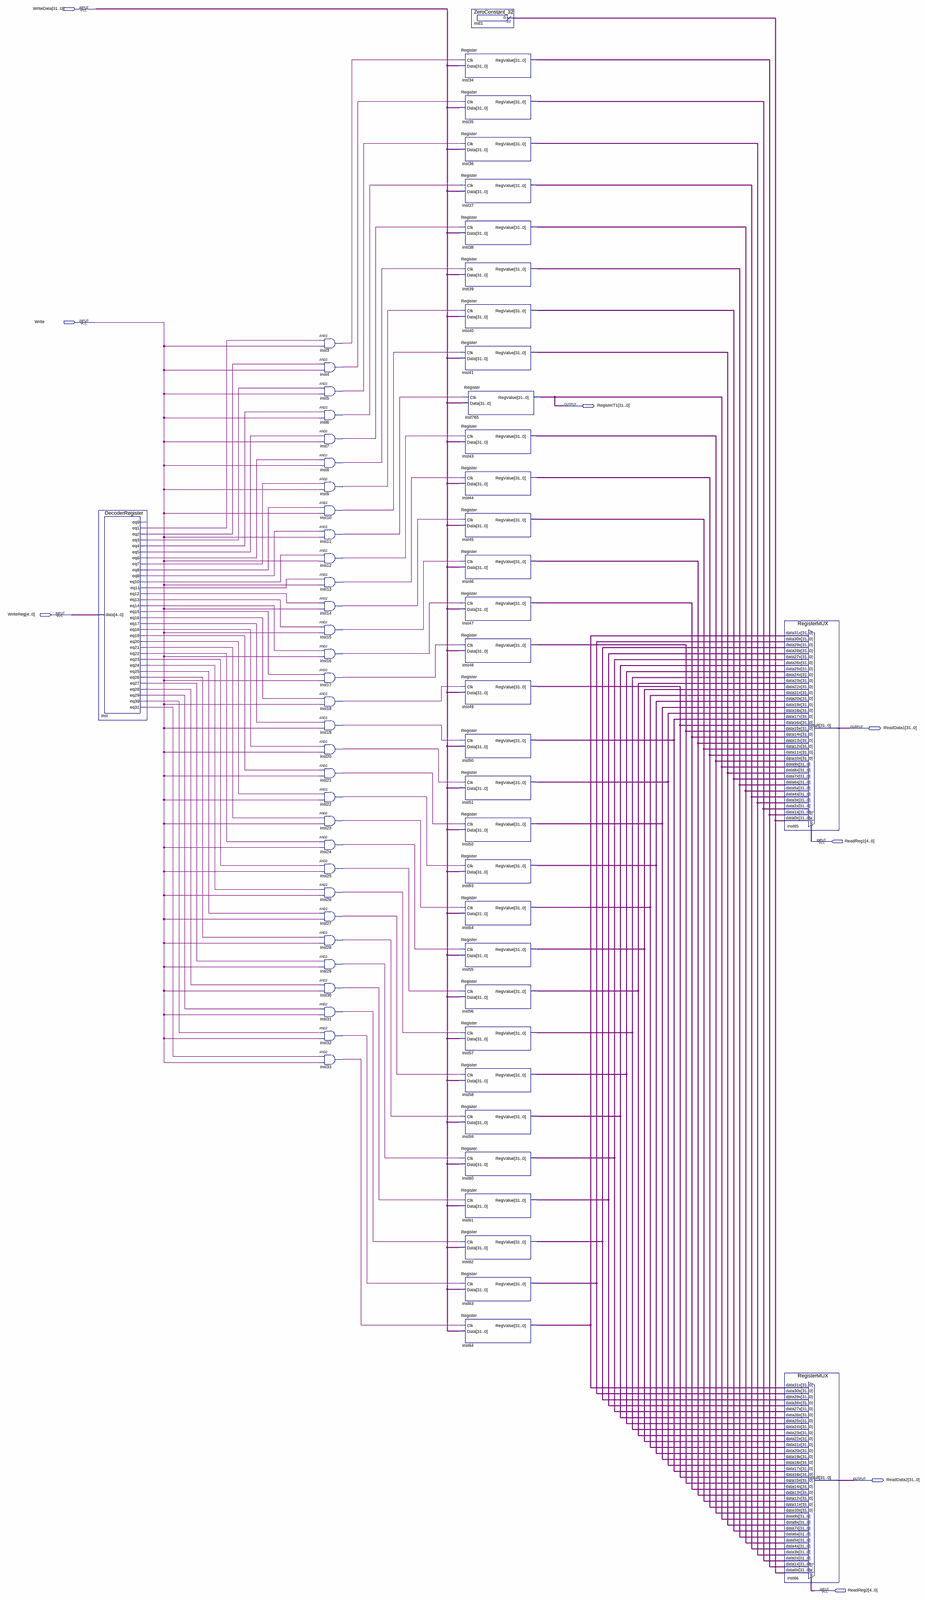
[diagram p0: schematic sheet, whole]
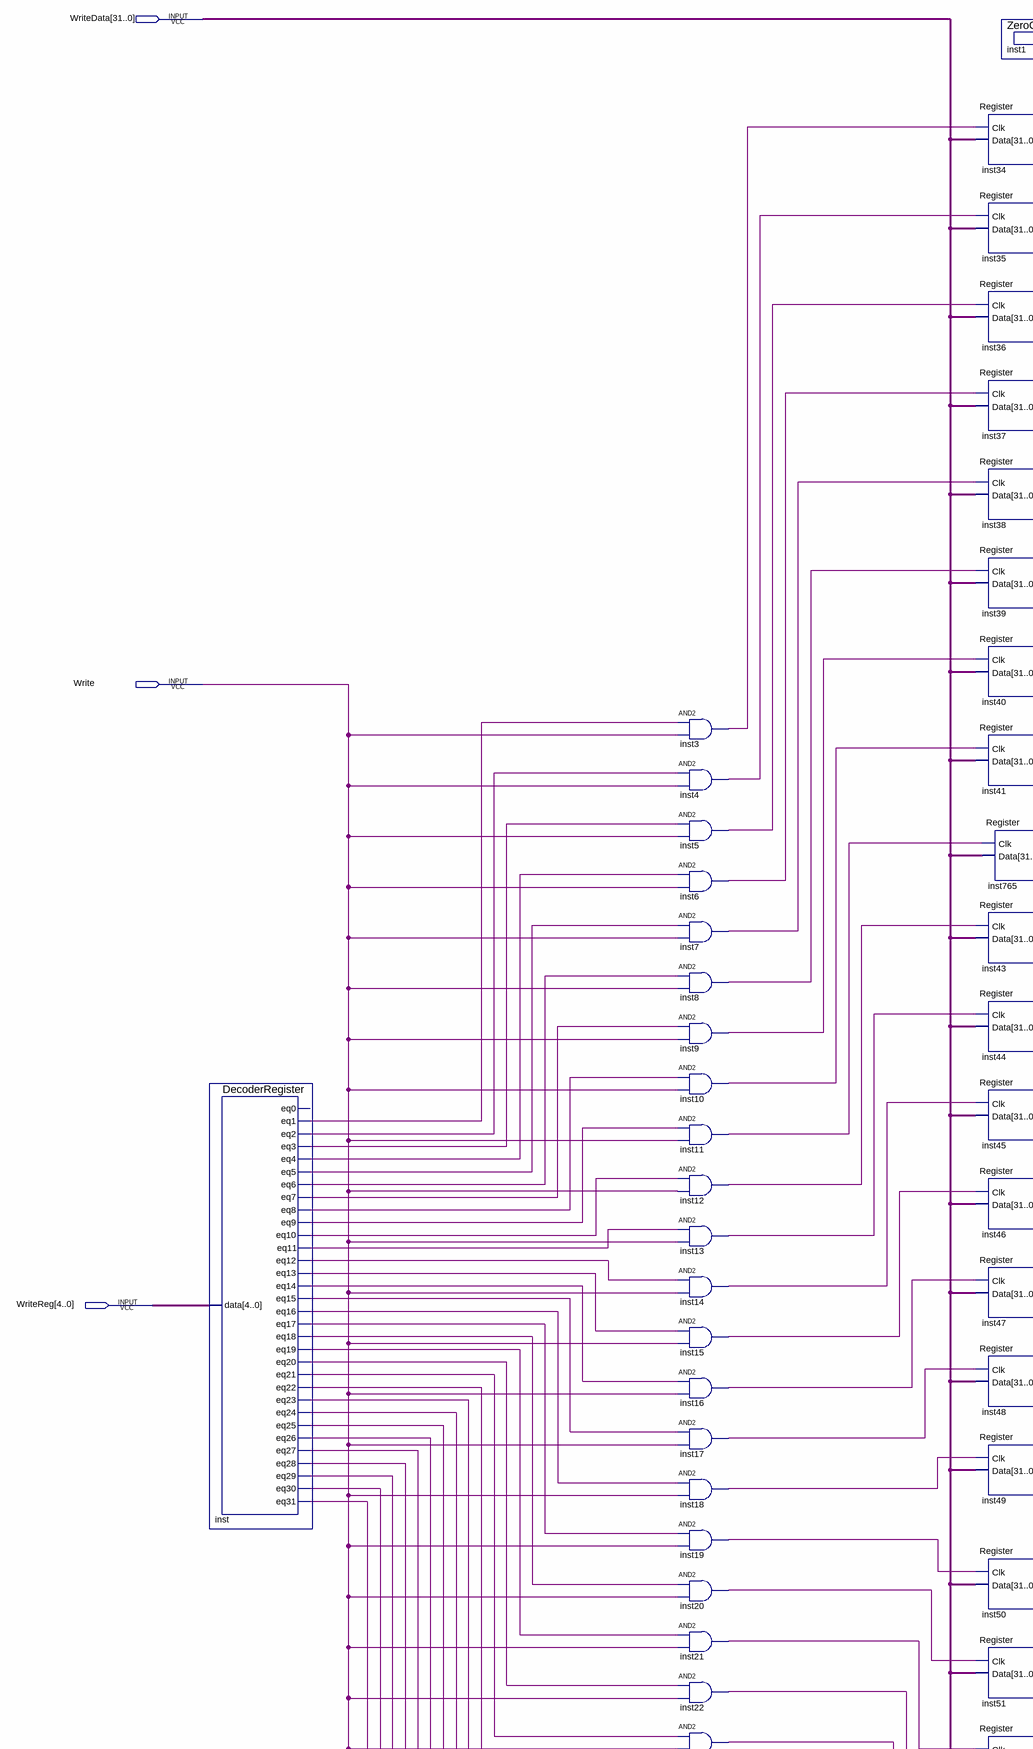
[diagram p1: schematic sheet, upper left part]
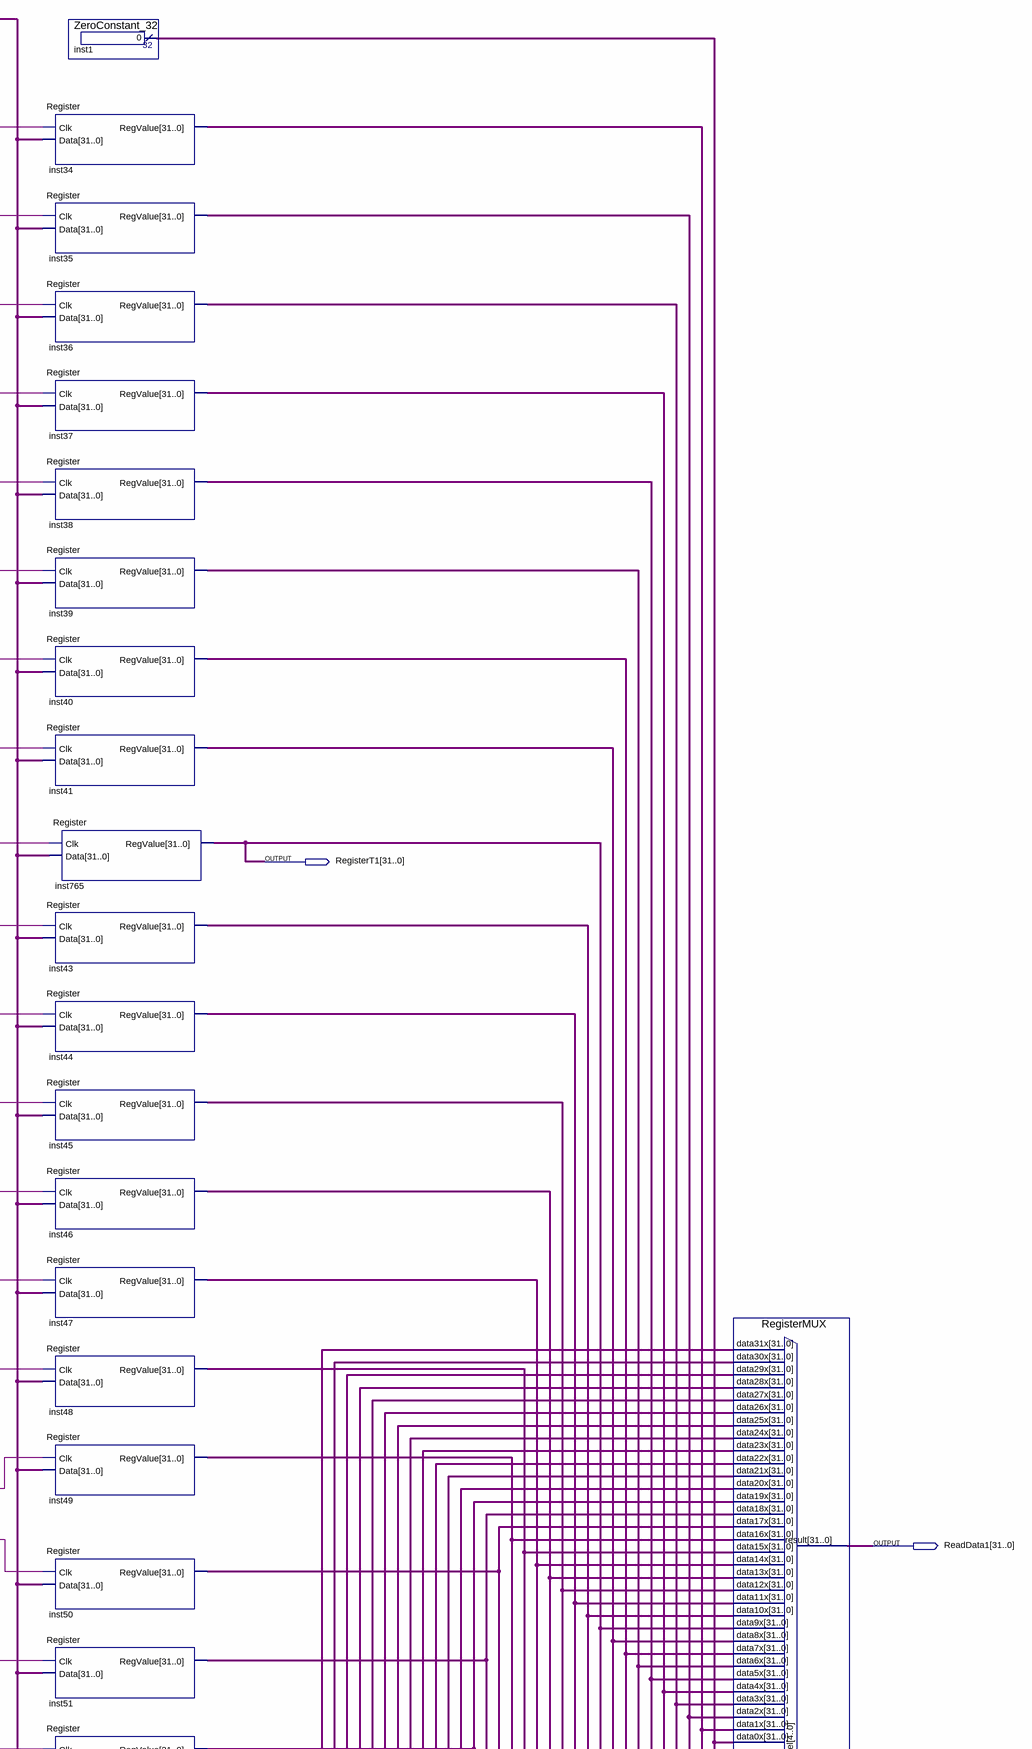
[diagram p2: schematic sheet, upper right part]
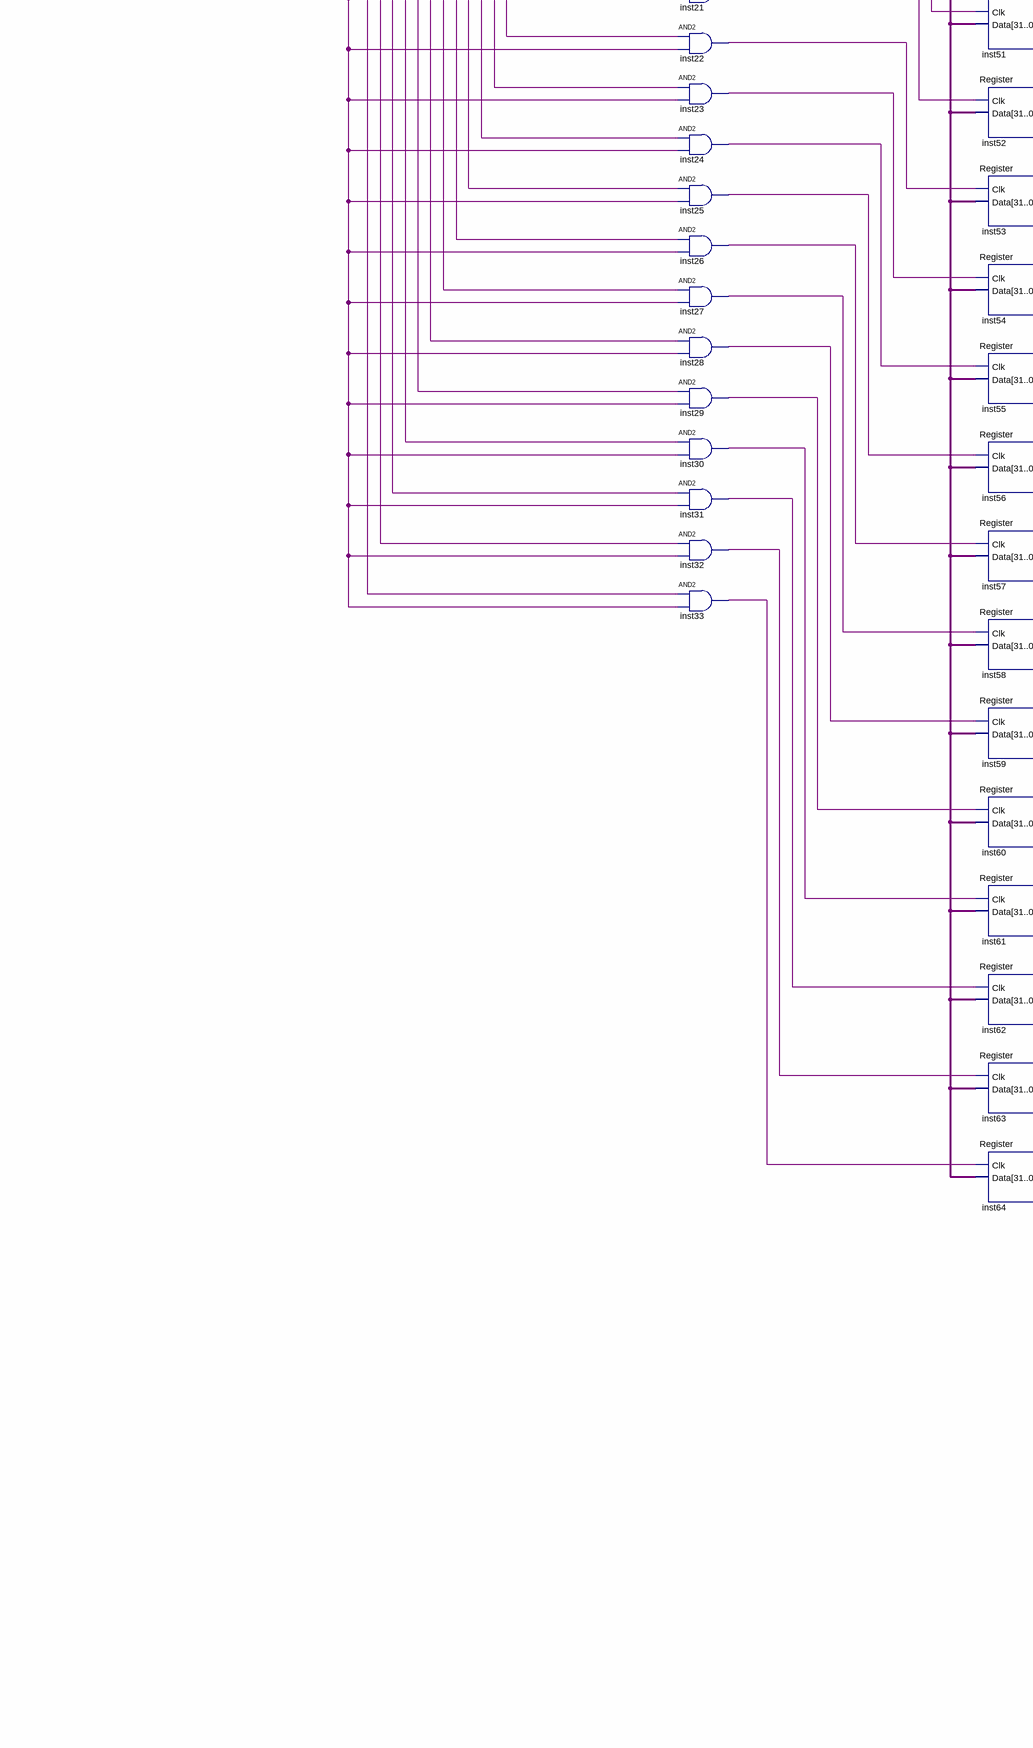
[diagram p3: schematic sheet, lower left part]
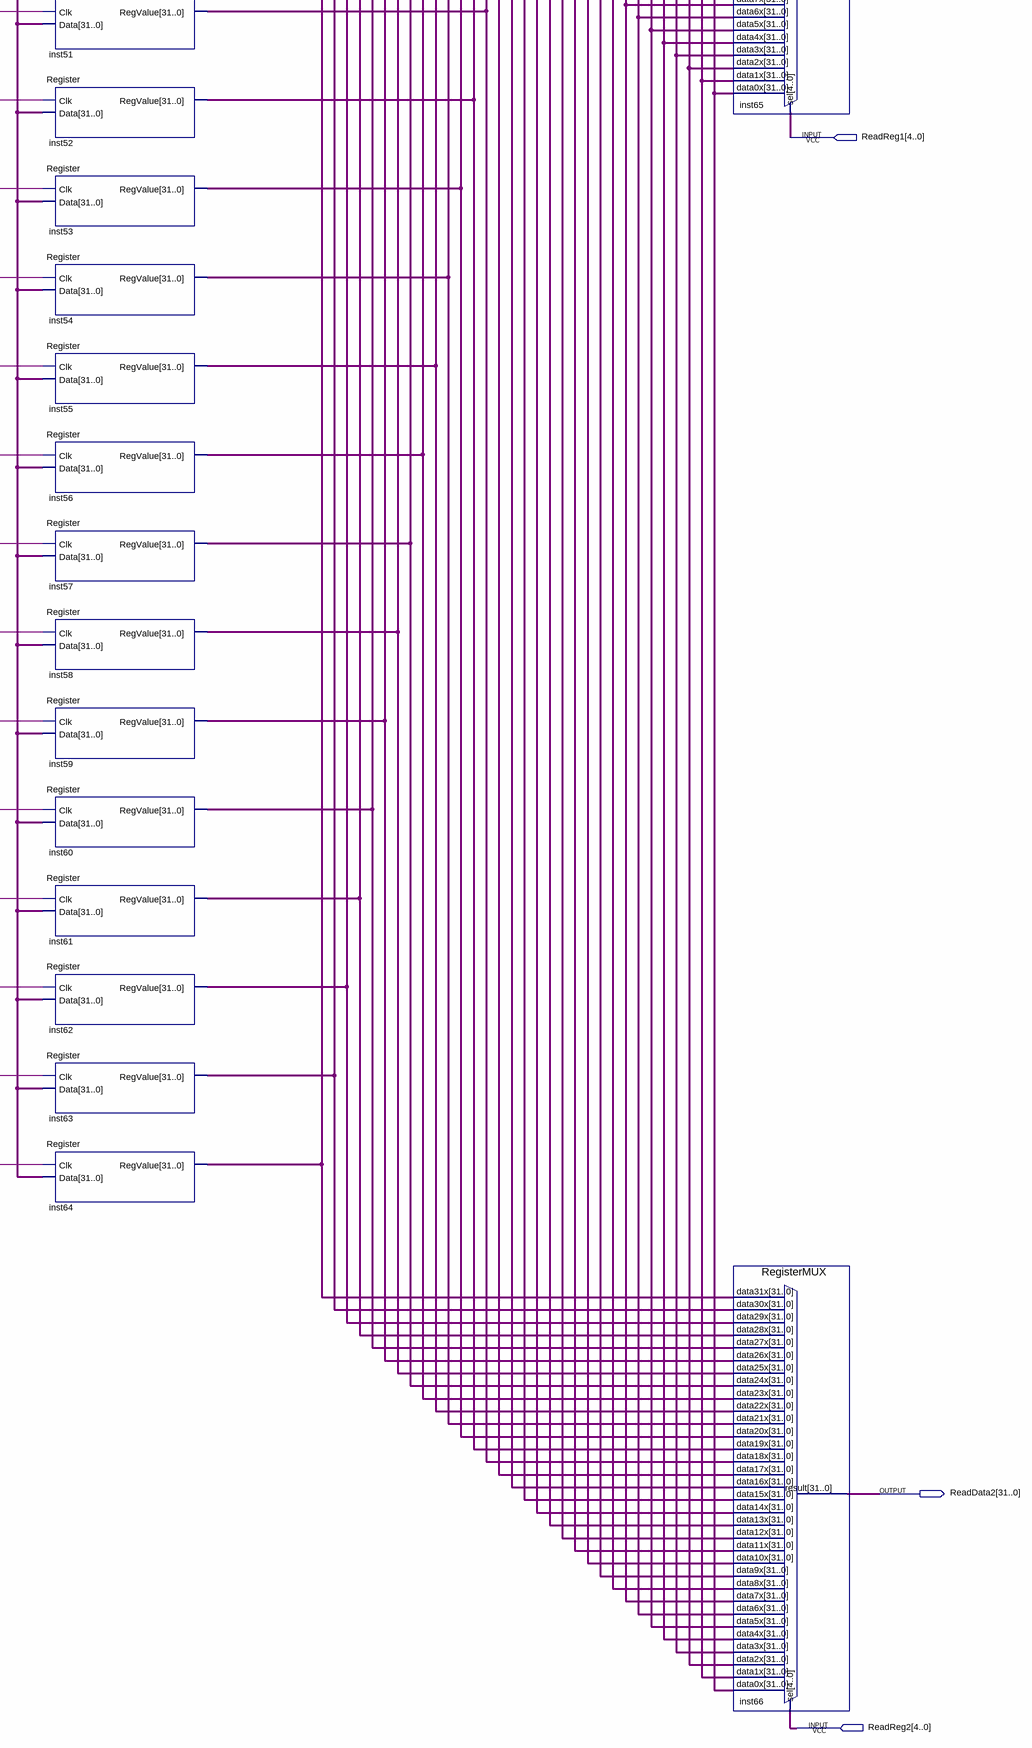
[diagram p4: schematic sheet, lower right part]
// Quartus schematic RegisterFile.bdf as structural Verilog: 66 symbols, 8 pins
module RegisterFile (
  input  [31:0] WriteData,
  input  Write,
  input  [4:0] WriteReg,
  input  [4:0] ReadReg1,
  input  [4:0] ReadReg2,
  output [31:0] RegisterT1,
  output [31:0] ReadData1,
  output [31:0] ReadData2
);

  wire inst3_out, inst4_out, inst5_out, inst6_out, inst7_out, inst8_out, inst9_out, inst10_out, inst11_out,
       inst12_out, inst13_out, inst14_out, inst15_out, inst16_out, inst17_out, inst18_out, inst19_out,
       inst20_out, inst21_out, inst22_out, inst23_out, inst24_out, inst25_out, inst26_out, inst27_out,
       inst28_out, inst29_out, inst30_out, inst31_out, inst32_out, inst33_out, inst_eq1, inst_eq2, inst_eq3,
       inst_eq4, inst_eq5, inst_eq6, inst_eq7, inst_eq8, inst_eq9, inst_eq10, inst_eq11, inst_eq12,
       inst_eq13, inst_eq14, inst_eq15, inst_eq16, inst_eq17, inst_eq18, inst_eq19, inst_eq20, inst_eq21,
       inst_eq22, inst_eq23, inst_eq24, inst_eq25, inst_eq26, inst_eq27, inst_eq28, inst_eq29, inst_eq30,
       inst_eq31;
  wire [31:0] inst1_result, inst34_regvalue, inst35_regvalue, inst36_regvalue, inst37_regvalue,
       inst38_regvalue, inst39_regvalue, inst40_regvalue, inst41_regvalue, inst43_regvalue, inst44_regvalue,
       inst45_regvalue, inst46_regvalue, inst47_regvalue, inst48_regvalue, inst49_regvalue, inst50_regvalue,
       inst51_regvalue, inst52_regvalue, inst53_regvalue, inst54_regvalue, inst55_regvalue, inst56_regvalue,
       inst57_regvalue, inst58_regvalue, inst59_regvalue, inst60_regvalue, inst61_regvalue, inst62_regvalue,
       inst63_regvalue, inst64_regvalue;

  DecoderRegister inst (
    .data(WriteReg), .eq1(inst_eq1), .eq2(inst_eq2), .eq3(inst_eq3), .eq4(inst_eq4), .eq5(inst_eq5),
    .eq6(inst_eq6), .eq7(inst_eq7), .eq8(inst_eq8), .eq9(inst_eq9), .eq10(inst_eq10), .eq11(inst_eq11),
    .eq12(inst_eq12), .eq13(inst_eq13), .eq14(inst_eq14), .eq15(inst_eq15), .eq16(inst_eq16),
    .eq17(inst_eq17), .eq18(inst_eq18), .eq19(inst_eq19), .eq20(inst_eq20), .eq21(inst_eq21),
    .eq22(inst_eq22), .eq23(inst_eq23), .eq24(inst_eq24), .eq25(inst_eq25), .eq26(inst_eq26),
    .eq27(inst_eq27), .eq28(inst_eq28), .eq29(inst_eq29), .eq30(inst_eq30), .eq31(inst_eq31));  // open: eq0
  and inst3 (inst3_out, inst_eq1, Write);
  and inst4 (inst4_out, inst_eq2, Write);
  and inst5 (inst5_out, inst_eq3, Write);
  and inst6 (inst6_out, inst_eq4, Write);
  and inst7 (inst7_out, inst_eq5, Write);
  and inst8 (inst8_out, inst_eq6, Write);
  and inst9 (inst9_out, inst_eq7, Write);
  and inst10 (inst10_out, inst_eq8, Write);
  and inst11 (inst11_out, inst_eq9, Write);
  and inst12 (inst12_out, inst_eq10, Write);
  and inst13 (inst13_out, inst_eq11, Write);
  and inst14 (inst14_out, inst_eq12, Write);
  and inst15 (inst15_out, inst_eq13, Write);
  and inst16 (inst16_out, inst_eq14, Write);
  and inst17 (inst17_out, inst_eq15, Write);
  and inst18 (inst18_out, inst_eq16, Write);
  and inst19 (inst19_out, inst_eq17, Write);
  and inst20 (inst20_out, inst_eq18, Write);
  and inst21 (inst21_out, inst_eq19, Write);
  and inst22 (inst22_out, inst_eq20, Write);
  and inst23 (inst23_out, inst_eq21, Write);
  and inst24 (inst24_out, inst_eq22, Write);
  and inst25 (inst25_out, inst_eq23, Write);
  and inst26 (inst26_out, inst_eq24, Write);
  and inst27 (inst27_out, inst_eq25, Write);
  and inst28 (inst28_out, inst_eq26, Write);
  and inst29 (inst29_out, inst_eq27, Write);
  and inst30 (inst30_out, inst_eq28, Write);
  and inst31 (inst31_out, inst_eq29, Write);
  and inst32 (inst32_out, inst_eq30, Write);
  and inst33 (inst33_out, inst_eq31, Write);
  ZeroConstant_32 inst1 (.result(inst1_result));
  Register inst34 (.Clk(inst3_out), .Data(WriteData), .RegValue(inst34_regvalue));
  Register inst35 (.Clk(inst4_out), .Data(WriteData), .RegValue(inst35_regvalue));
  Register inst36 (.Clk(inst5_out), .Data(WriteData), .RegValue(inst36_regvalue));
  Register inst37 (.Clk(inst6_out), .Data(WriteData), .RegValue(inst37_regvalue));
  Register inst38 (.Clk(inst7_out), .Data(WriteData), .RegValue(inst38_regvalue));
  Register inst39 (.Clk(inst8_out), .Data(WriteData), .RegValue(inst39_regvalue));
  Register inst40 (.Clk(inst9_out), .Data(WriteData), .RegValue(inst40_regvalue));
  Register inst41 (.Clk(inst10_out), .Data(WriteData), .RegValue(inst41_regvalue));
  Register inst765 (.Clk(inst11_out), .Data(WriteData), .RegValue(RegisterT1));
  Register inst43 (.Clk(inst12_out), .Data(WriteData), .RegValue(inst43_regvalue));
  Register inst44 (.Clk(inst13_out), .Data(WriteData), .RegValue(inst44_regvalue));
  Register inst45 (.Clk(inst14_out), .Data(WriteData), .RegValue(inst45_regvalue));
  Register inst46 (.Clk(inst15_out), .Data(WriteData), .RegValue(inst46_regvalue));
  Register inst47 (.Clk(inst16_out), .Data(WriteData), .RegValue(inst47_regvalue));
  Register inst48 (.Clk(inst17_out), .Data(WriteData), .RegValue(inst48_regvalue));
  Register inst49 (.Clk(inst18_out), .Data(WriteData), .RegValue(inst49_regvalue));
  Register inst50 (.Clk(inst19_out), .Data(WriteData), .RegValue(inst50_regvalue));
  Register inst51 (.Clk(inst20_out), .Data(WriteData), .RegValue(inst51_regvalue));
  Register inst52 (.Clk(inst21_out), .Data(WriteData), .RegValue(inst52_regvalue));
  Register inst53 (.Clk(inst22_out), .Data(WriteData), .RegValue(inst53_regvalue));
  Register inst54 (.Clk(inst23_out), .Data(WriteData), .RegValue(inst54_regvalue));
  Register inst55 (.Clk(inst24_out), .Data(WriteData), .RegValue(inst55_regvalue));
  Register inst56 (.Clk(inst25_out), .Data(WriteData), .RegValue(inst56_regvalue));
  Register inst57 (.Clk(inst26_out), .Data(WriteData), .RegValue(inst57_regvalue));
  Register inst58 (.Clk(inst27_out), .Data(WriteData), .RegValue(inst58_regvalue));
  Register inst59 (.Clk(inst28_out), .Data(WriteData), .RegValue(inst59_regvalue));
  Register inst60 (.Clk(inst29_out), .Data(WriteData), .RegValue(inst60_regvalue));
  Register inst61 (.Clk(inst30_out), .Data(WriteData), .RegValue(inst61_regvalue));
  Register inst62 (.Clk(inst31_out), .Data(WriteData), .RegValue(inst62_regvalue));
  Register inst63 (.Clk(inst32_out), .Data(WriteData), .RegValue(inst63_regvalue));
  Register inst64 (.Clk(inst33_out), .Data(WriteData), .RegValue(inst64_regvalue));
  RegisterMUX inst65 (
    .data31x(inst64_regvalue), .data30x(inst63_regvalue), .data29x(inst62_regvalue),
    .data28x(inst61_regvalue), .data27x(inst60_regvalue), .data26x(inst59_regvalue),
    .data25x(inst58_regvalue), .data24x(inst57_regvalue), .data23x(inst56_regvalue),
    .data22x(inst55_regvalue), .data21x(inst54_regvalue), .data20x(inst53_regvalue),
    .data19x(inst52_regvalue), .data18x(inst51_regvalue), .data17x(inst50_regvalue),
    .data16x(inst49_regvalue), .data15x(inst48_regvalue), .data14x(inst47_regvalue),
    .data13x(inst46_regvalue), .data12x(inst45_regvalue), .data11x(inst44_regvalue),
    .data10x(inst43_regvalue), .data9x(RegisterT1), .data8x(inst41_regvalue), .data7x(inst40_regvalue),
    .data6x(inst39_regvalue), .data5x(inst38_regvalue), .data4x(inst37_regvalue), .data3x(inst36_regvalue),
    .data2x(inst35_regvalue), .data1x(inst34_regvalue), .data0x(inst1_result), .sel(ReadReg1),
    .result(ReadData1));
  RegisterMUX inst66 (
    .data31x(inst64_regvalue), .data30x(inst63_regvalue), .data29x(inst62_regvalue),
    .data28x(inst61_regvalue), .data27x(inst60_regvalue), .data26x(inst59_regvalue),
    .data25x(inst58_regvalue), .data24x(inst57_regvalue), .data23x(inst56_regvalue),
    .data22x(inst55_regvalue), .data21x(inst54_regvalue), .data20x(inst53_regvalue),
    .data19x(inst52_regvalue), .data18x(inst51_regvalue), .data17x(inst50_regvalue),
    .data16x(inst49_regvalue), .data15x(inst48_regvalue), .data14x(inst47_regvalue),
    .data13x(inst46_regvalue), .data12x(inst45_regvalue), .data11x(inst44_regvalue),
    .data10x(inst43_regvalue), .data9x(RegisterT1), .data8x(inst41_regvalue), .data7x(inst40_regvalue),
    .data6x(inst39_regvalue), .data5x(inst38_regvalue), .data4x(inst37_regvalue), .data3x(inst36_regvalue),
    .data2x(inst35_regvalue), .data1x(inst34_regvalue), .data0x(inst1_result), .sel(ReadReg2),
    .result(ReadData2));
endmodule
